# EAGLE schematic atmega2561 (EAGLE 9.6.2)
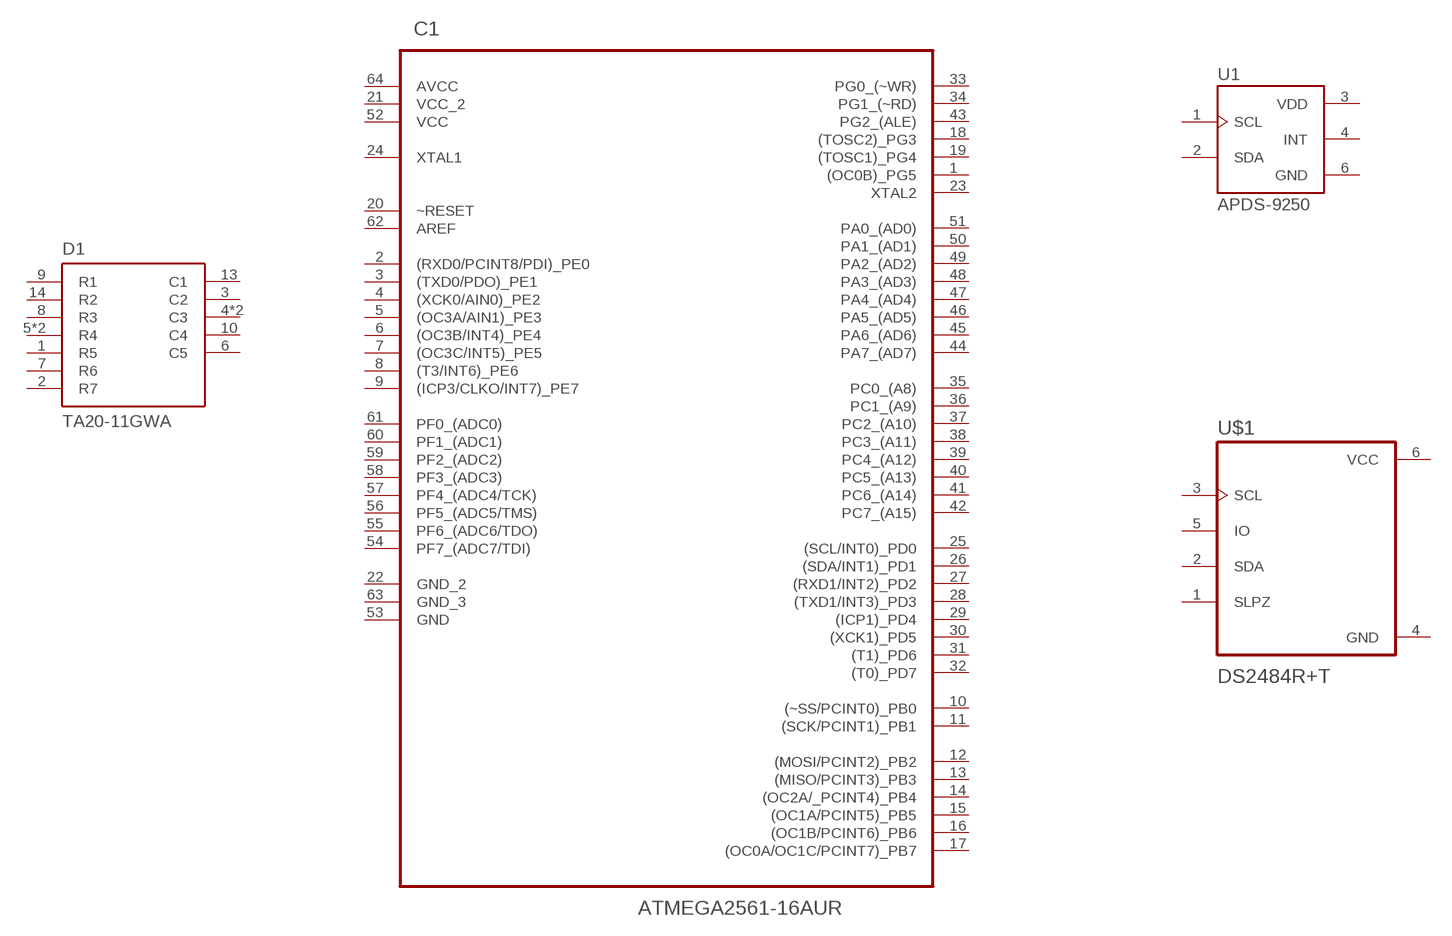
[diagram p0: schematic, sheet 1]

## Parts
C1  ATMEGA2561-16AUR  [QFP80P1600X1600X120-64N]
D1  TA20-11GWA  [LED_TA20-11GWA]
U1  APDS-9250  [SON65P200X200X75-6N]
U$1  DS2484R+T  [SOT95P280X145-6N]
Unconnected: C1.1((OC0B)_PG5) C1.2((RXD0/PCINT8/PDI)_PE0) C1.3((TXD0/PDO)_PE1) C1.4((XCK0/AIN0)_PE2) C1.5((OC3A/AIN1)_PE3) C1.6((OC3B/INT4)_PE4) C1.7((OC3C/INT5)_PE5) C1.8((T3/INT6)_PE6) C1.9((ICP3/CLKO/INT7)_PE7) C1.10((~SS/PCINT0)_PB0) C1.11((SCK/PCINT1)_PB1) C1.12((MOSI/PCINT2)_PB2) C1.13((MISO/PCINT3)_PB3) C1.14((OC2A/_PCINT4)_PB4) C1.15((OC1A/PCINT5)_PB5) C1.16((OC1B/PCINT6)_PB6) C1.17((OC0A/OC1C/PCINT7)_PB7) C1.18((TOSC2)_PG3) C1.19((TOSC1)_PG4) C1.20(~RESET) C1.22(GND_2) C1.23(XTAL2) C1.24(XTAL1) C1.25((SCL/INT0)_PD0) C1.26((SDA/INT1)_PD1) C1.27((RXD1/INT2)_PD2) C1.28((TXD1/INT3)_PD3) C1.29((ICP1)_PD4) C1.30((XCK1)_PD5) C1.31((T1)_PD6) C1.32((T0)_PD7) C1.33(PG0_(~WR)) C1.34(PG1_(~RD)) C1.35(PC0_(A8)) C1.36(PC1_(A9)) C1.37(PC2_(A10)) C1.38(PC3_(A11)) C1.39(PC4_(A12)) C1.40(PC5_(A13)) C1.41(PC6_(A14)) C1.42(PC7_(A15)) C1.43(PG2_(ALE)) C1.44(PA7_(AD7)) C1.45(PA6_(AD6)) C1.46(PA5_(AD5)) C1.47(PA4_(AD4)) C1.48(PA3_(AD3)) C1.49(PA2_(AD2)) C1.50(PA1_(AD1)) C1.51(PA0_(AD0)) C1.53(GND) C1.54(PF7_(ADC7/TDI)) C1.55(PF6_(ADC6/TDO)) C1.56(PF5_(ADC5/TMS)) C1.57(PF4_(ADC4/TCK)) C1.58(PF3_(ADC3)) C1.59(PF2_(ADC2)) C1.60(PF1_(ADC1)) C1.61(PF0_(ADC0)) C1.62(AREF) C1.63(GND_3) D1.1(R5) D1.2(R7) D1.3(C2) D1.4(C3) D1.5(R4) D1.6(C5) D1.7(R6) D1.8(R3) D1.9(R1) D1.10(C4) D1.11(C3) D1.12(R4) D1.13(C1) D1.14(R2) U1.1(SCL) U1.2(SDA) U1.4(INT) U$1.1(SLPZ) U$1.2(SDA) U$1.3(SCL) U$1.5(IO)

## Power pins joined to a net without a drawn wire
AVCC: C1.64(AVCC)
GND: U1.6(GND) U$1.4(GND)
VCC: C1.52(VCC) U$1.6(VCC)
VCC_2: C1.21(VCC_2)
VDD: U1.3(VDD)

## Library data of the parts
C1 = ATMEGA2561-16AUR:ATMEGA2561-16AUR: Microcontroller Check prices <https://pricing.snapeda.com/parts/ATMEGA2561-16AUR/Microchip/view-part?ref=eda>; AVAILABILITY: In Stock; DESCRIPTION: AVR AVR® ATmega Microcontroller IC 8-Bit 16MHz 256KB (128K x 16) FLASH 64-TQFP (14x14); MF: Microchip; MP: ATMEGA2561-16AUR; PACKAGE: TQFP-64 Microchip Technology; PRICE: None
D1 = TA20-11GWA:TA20-11GWA: LED Displays & Accessories Check prices <https://pricing.snapeda.com/parts/TA20-11GWA/Kingbright/view-part?ref=eda>; AVAILABILITY: In Stock; DESCRIPTION: Dot Matrix Display Module 5 x 7 Common Cathode Row, Common Anode Column Green 2.2V 1.50 L x 2.09 W x 0.33 H (38.10mm x 53.10mm x 8.50mm); MF: Kingbright; MP: TA20-11GWA; PACKAGE: DIP-40 Kingbright; PRICE: None
U1 = APDS-9250:APDS-9250: Digital RGB, IR and Ambient Light Sensor with I2C Output Check prices <https://pricing.snapeda.com/parts/APDS-9250/Broadcom%20Limited/view-part?ref=eda>; AVAILABILITY: In Stock; DESCRIPTION: Optical Sensor Ambient 550nm I²C 6-SMD Module; MF: Broadcom Limited; MP: APDS-9250; PACKAGE: - Avago; PRICE: None
U$1 = DS2484R_T:DS2484R+T: Check prices <https://pricing.snapeda.com/parts/DS2484R%2BT/Maxim%20Integrated/view-part?ref=eda>; AVAILABILITY: In Stock; DESCRIPTION: 1-Wire® Controller I²C Interface SOT-23-6; MF: Maxim Integrated; MP: DS2484R+T; PACKAGE: SOT-23-5 Maxim Integrated; PRICE: None